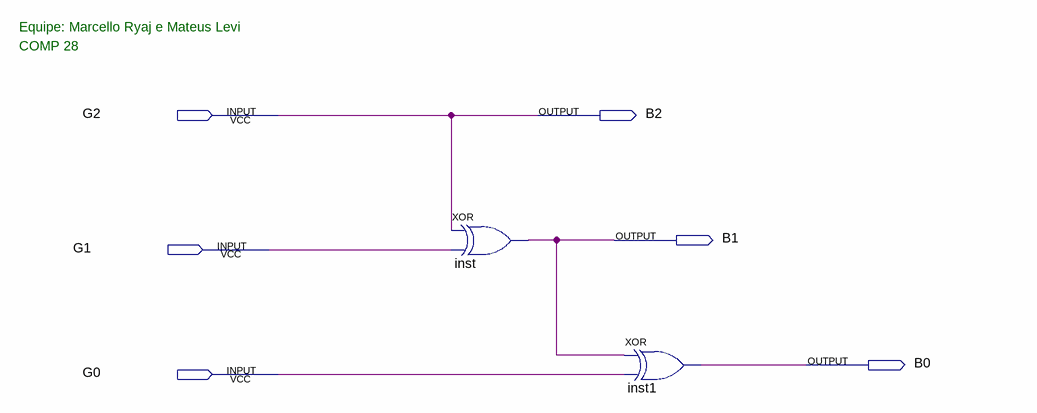
[diagram p0: schematic sheet]
// Quartus schematic exercicio2.bdf as structural Verilog: 2 symbols, 6 pins
module exercicio2 (
  input  G2,
  input  G1,
  input  G0,
  output B2,
  output B1,
  output B0
);

  xor inst (B1, G2, G1);
  xor inst1 (B0, B1, G0);

  assign B2 = G2;

  // Notes on the sheet:
  //   Equipe: Marcello Ryaj e Mateus Levi
  //   COMP 28
endmodule
